# Altium project nanoDAP.PrjPcb
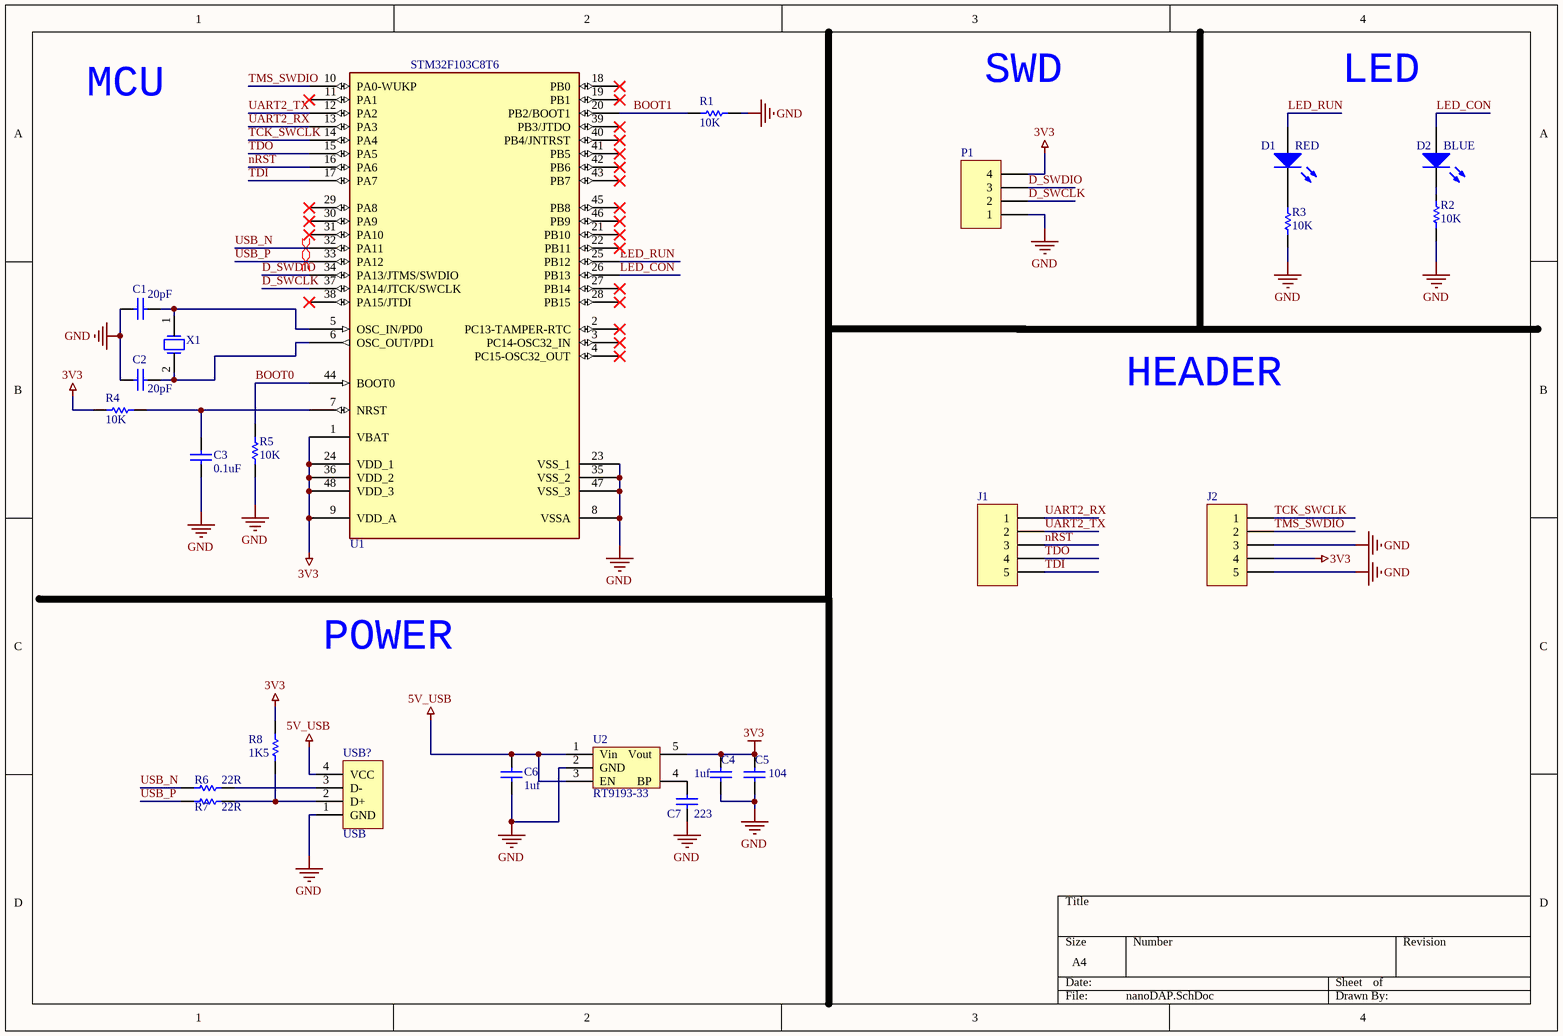
[diagram p0: nanoDAP.SchDoc]
1 sheet, 25 parts. Net scope: global (net labels, ports and power ports of the same name join across sheets).
Board file: nanoDAP.PcbDoc

## Sheet nanoDAP.SchDoc
size A4

### Parts
C1  value 20pF  [0603_C]  (hidden comment: C0603)
C2  value 20pF  [0603_C]  (hidden comment: C0603)
C3  value 0.1uF  [0603_C]  (hidden comment: C0603)
C4  1uf  [0603_C]
C5  104  [0603_C]
C6  1uf  [0603_C]
C7  223  [0603_C]
D1  RED  [0603_LED]
D2  BLUE  [0603_LED]
J1  Header 5  [HEADER_SMT_5]  (value not drawn)
J2  Header 5  [HEADER_SMT_5]  (value not drawn)
logo1  logo  [LOGO]  (value not drawn)
P1  Header 4  [HEADER_4x1]  (value not drawn)
R1  value 10K  [0603_R]  (hidden comment: R0603)
R2  value 10K  [0603_R]  (hidden comment: R0603)
R3  value 10K  [0603_R]  (hidden comment: R0603)
R4  value 10K  [0603_R]  (hidden comment: R0603)
R5  value 10K  [0603_R]  (hidden comment: R0603)
R6  value 22R  [0603_R]  (hidden comment: R0603)
R7  value 22R  [0603_R]  (hidden comment: R0603)
R8  value 1K5  [0603_R]  (hidden comment: R0603)
U1  STM32F103C8T6  [LQFP48_N]
U2  RT9193-33  [SOT23-5]
USB?  USB  [USB_A_G]
X1  XTAL  [49SMD]  (value not drawn)

### Nets
3V3: C4.2 C5.2 J2.4 P1.4 R4.2 R8.2 U1.1(VBAT) U1.9(VDD_A) U1.24(VDD_1) U1.36(VDD_2) U1.48(VDD_3) U2.5(Vout)
5V_USB: C6.2 U2.1(Vin) U2.3(EN) USB?.4(VCC)
GND: C1.2 C2.2 C3.1 C4.1 C5.1 C6.1 C7.1 J2.3 J2.5 P1.1 R1.1 R2.1 R3.1 R5.2 U1.8(VSSA) U1.23(VSS_1) U1.35(VSS_2) U1.47(VSS_3) U2.2(GND) USB?.1(GND)
BOOT0: R5.1 U1.44(BOOT0)
BOOT1: R1.2 U1.20(PB2/BOOT1)
D_SWCLK: P1.2 U1.37(PA14/JTCK/SWCLK)
D_SWDIO: P1.3 U1.34(PA13/JTMS/SWDIO)
LED_CON: D2.1(A) U1.26(PB13)
LED_RUN: D1.1(A) U1.25(PB12)
nRST: J1.3 U1.16(PA6)
TCK_SWCLK: J2.1 U1.14(PA4)
TDI: J1.5 U1.17(PA7)
TDO: J1.4 U1.15(PA5)
TMS_SWDIO: J2.2 U1.10(PA0-WUKP)
UART2_RX: J1.1 U1.13(PA3)
UART2_TX: J1.2 U1.12(PA2)
USB_N: R6.1 U1.32(PA11)
USB_P: R7.1 U1.33(PA12)
NetC1_1: C1.1 U1.5(OSC_IN/PD0) X1.1
NetC2_1: C2.1 U1.6(OSC_OUT/PD1) X1.2
NetC3_2: C3.2 R4.1 U1.7(NRST)
NetC7_2: C7.2 U2.4(BP)
NetD1_2: D1.2(K) R3.2
NetD2_2: D2.2(K) R2.2
NetR6_2: R6.2 USB?.3(D-)
NetR7_2: R7.2 R8.1 USB?.2(D+)

Not connected (* = marked no-connect by the designer): U1 2(PC13-TAMPER-RTC)* 3(PC14-OSC32_IN)* 4(PC15-OSC32_OUT)* 11(PA1)* 18(PB0)* 19(PB1)* 21(PB10)* 22(PB11)* 27(PB14)* 28(PB15)* 29(PA8)* 30(PA9)* 31(PA10)* 38(PA15/JTDI)* 39(PB3/JTDO)* 40(PB4/JNTRST)* 41(PB5)* 42(PB6)* 43(PB7)* 45(PB8)* 46(PB9)*

### Layout directives
differential pair: USB_N, USB_P

### Notes on the sheet
- (near logo1) MCU
- SWD
- LED
- HEADER
- POWER

### Library data of the parts
C1-C3 = C0603: Capacitor; Published: 8-Jun-2000; LatestRevisionDate: 17-Jul-2002; LatestRevisionNote: Re-released for DXP Platform.; PackageReference: RAD-0.3; Publisher: Altium Limited; PackageDescription: Radial Cap, Thru-Hole; 2 Leads; 0.3 in Pin Spacing
C4 C6 C7 = CAP: Capacitor
  C4 C6: value: 1uF
  C7: value: 223
C5 = CAP: Capacitor; value: 0.1uF
D1 D2 = D0603: Typical RED, GREEN, YELLOW, AMBER GaAs LED; Published: 8-Jun-2000; LatestRevisionDate: 17-Jul-2002; LatestRevisionNote: Re-released for DXP Platform.; PackageVersion: Feb-2002; PackageReference: 3.2X1.6X1.1; Publisher: Altium Limited; PackageDescription: SM LED; 2 Flat Leads
J1 J2 = Header_5: Header, 4-Pin; LatestRevisionDate: 17-Jul-2002; LatestRevisionNote: Re-released for DXP Platform.; Publisher: Altium Limited
P1 = Header 4: Header, 4-Pin; LatestRevisionDate: 17-Jul-2002; LatestRevisionNote: Re-released for DXP Platform.; Publisher: Altium Limited
R1-R8 = R0603: Resistor; Published: 8-Jun-2000; LatestRevisionDate: 17-Jul-2002; LatestRevisionNote: Re-released for DXP Platform.; PackageReference: AXIAL-0.3; Publisher: Altium Limited; PackageDescription: Axial Device, Thru-Hole; 2 Leads; 0.3 in Pin Spacing
U1 = STM32F103C8T6: LowPower MCU
USB? = USB_G
X1 = XTAL: value: 8MHz